# Altium schematic sheet FPGA_Supply.SchDoc: RNG RPI Interface
size 420 x 297 mm; Author: G.Kasprowicz; CompanyName: WUT ISE; DrawnBy: G.Kasprowicz; Organization: WUT ISE; Address1: PW ISE; Address2: Nowowiejska 15/19 00-665 Warsaw; Address3: gkasprow@gmail.com; Revision: 2; SheetNumber: -; SheetTotal: -; ModifiedBy: -; CheckedDate: -; Title2: FPGA supply; DivGrp: WUT ISE; Designer: G.Kasprowicz; ModifiedDate: -; ProjectName: Sensor Box
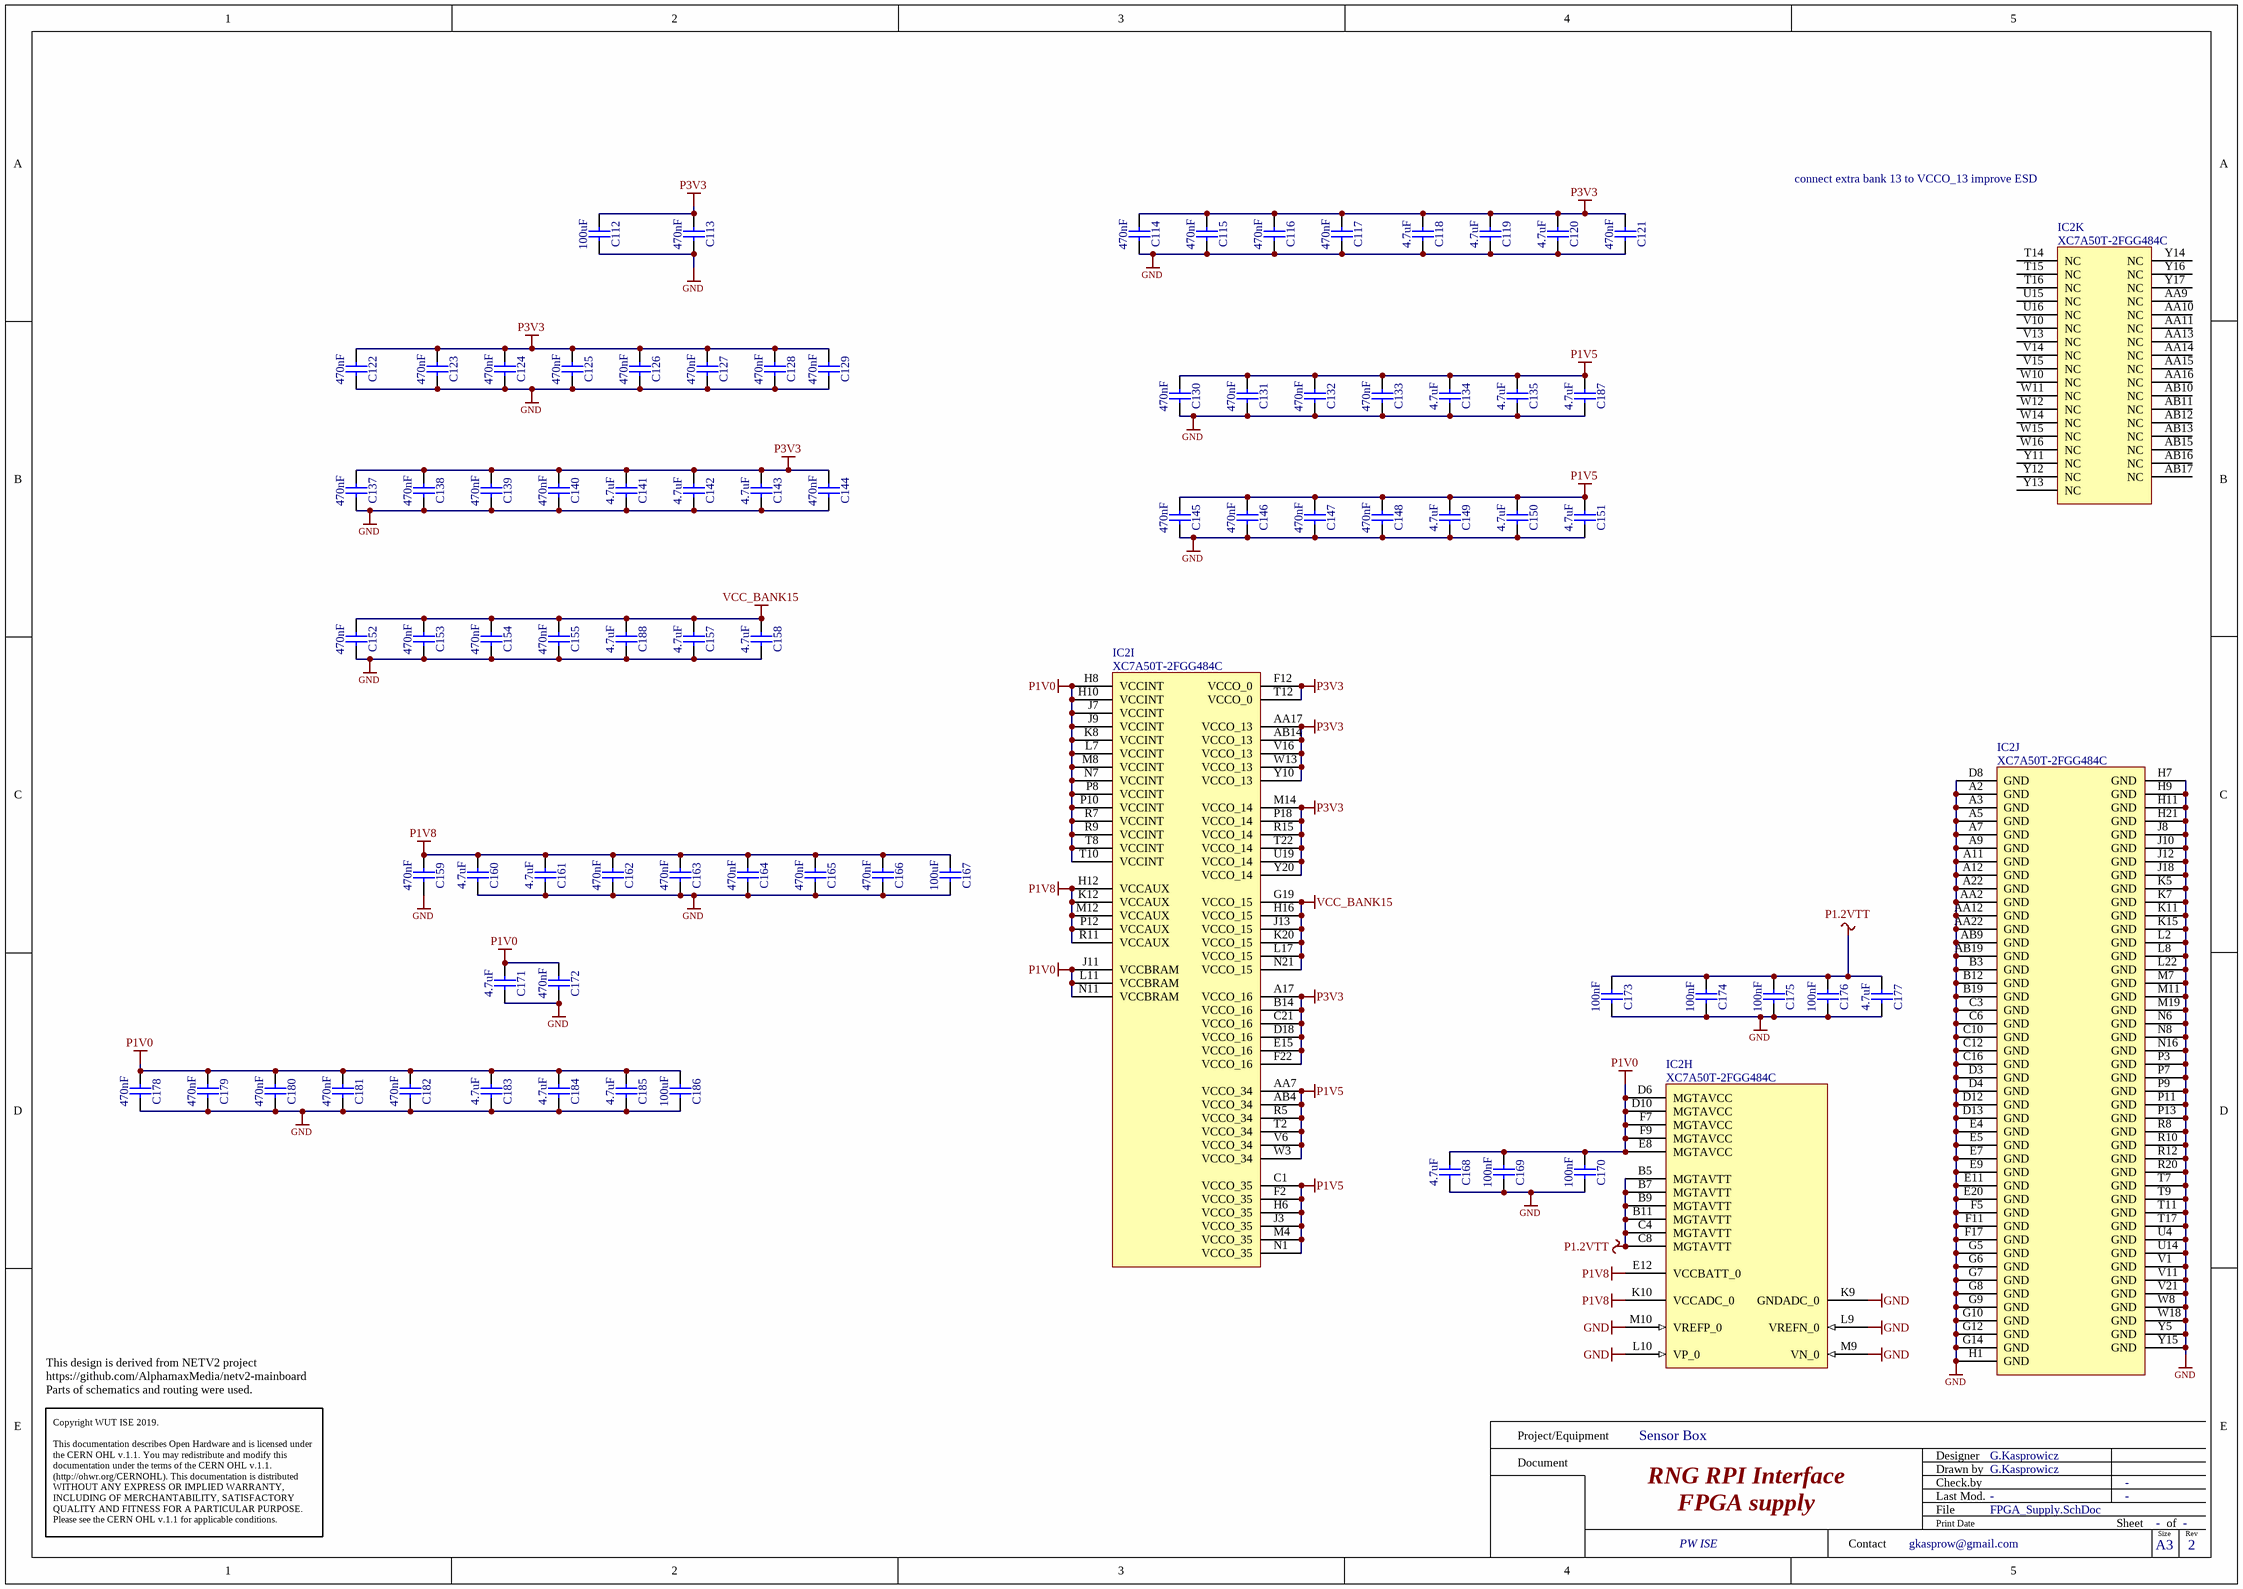
[diagram p0: FPGA_Supply.SchDoc]

## Parts
C112  100uF  [CAPC3216X180N]
C113  470nF  [CAPC0603X33N]
C114  470nF  [CAPC0603X33N]
C115  470nF  [CAPC0603X33N]
C116  470nF  [CAPC0603X33N]
C117  470nF  [CAPC0603X33N]
C118  4.7uF  [CAPC1005X55N]
C119  4.7uF  [CAPC1005X55N]
C120  4.7uF  [CAPC1005X55N]
C121  470nF  [CAPC0603X33N]
C122  470nF  [CAPC0603X33N]
C123  470nF  [CAPC0603X33N]
C124  470nF  [CAPC0603X33N]
C125  470nF  [CAPC0603X33N]
C126  470nF  [CAPC0603X33N]
C127  470nF  [CAPC0603X33N]
C128  470nF  [CAPC0603X33N]
C129  470nF  [CAPC0603X33N]
C130  470nF  [CAPC0603X33N]
C131  470nF  [CAPC0603X33N]
C132  470nF  [CAPC0603X33N]
C133  470nF  [CAPC0603X33N]
C134  4.7uF  [CAPC1005X55N]
C135  4.7uF  [CAPC1005X55N]
C137  470nF  [CAPC0603X33N]
C138  470nF  [CAPC0603X33N]
C139  470nF  [CAPC0603X33N]
C140  470nF  [CAPC0603X33N]
C141  4.7uF  [CAPC1005X55N]
C142  4.7uF  [CAPC1005X55N]
C143  4.7uF  [CAPC1005X55N]
C144  470nF  [CAPC0603X33N]
C145  470nF  [CAPC0603X33N]
C146  470nF  [CAPC0603X33N]
C147  470nF  [CAPC0603X33N]
C148  470nF  [CAPC0603X33N]
C149  4.7uF  [CAPC1005X55N]
C150  4.7uF  [CAPC1005X55N]
C151  4.7uF  [CAPC1005X55N]
C152  470nF  [CAPC0603X33N]
C153  470nF  [CAPC0603X33N]
C154  470nF  [CAPC0603X33N]
C155  470nF  [CAPC0603X33N]
C157  4.7uF  [CAPC1005X55N]
C158  4.7uF  [CAPC1005X55N]
C159  470nF  [CAPC0603X33N]
C160  4.7uF  [CAPC1005X55N]
C161  4.7uF  [CAPC1005X55N]
C162  470nF  [CAPC0603X33N]
C163  470nF  [CAPC0603X33N]
C164  470nF  [CAPC0603X33N]
C165  470nF  [CAPC0603X33N]
C166  470nF  [CAPC0603X33N]
C167  100uF  [CAPC3216X180N]
C168  4.7uF  [CAPC1005X55N]
C169  100nF  [CAPC0603X33N]
C170  100nF  [CAPC0603X33N]
C171  4.7uF  [CAPC1005X55N]
C172  470nF  [CAPC0603X33N]
C173  100nF  [CAPC0603X33N]
C174  100nF  [CAPC0603X33N]
C175  100nF  [CAPC0603X33N]
C176  100nF  [CAPC0603X33N]
C177  4.7uF  [CAPC1005X55N]
C178  470nF  [CAPC0603X33N]
C179  470nF  [CAPC0603X33N]
C180  470nF  [CAPC0603X33N]
C181  470nF  [CAPC0603X33N]
C182  470nF  [CAPC0603X33N]
C183  4.7uF  [CAPC1005X55N]
C184  4.7uF  [CAPC1005X55N]
C185  4.7uF  [CAPC1005X55N]
C186  100uF  [CAPC3216X180N]
C187  4.7uF  [CAPC1005X55N]
C188  4.7uF  [CAPC1005X55N]
IC2  XC7A50T-2FGG484C  [BGA484C100P22X22_2300X2300X260]  (parts H,I,J,K of 11)

## Nets
GND: C112.2 C113.2 C114.2 C115.2 C116.2 C117.2 C118.2 C119.2 C120.2 C121.2 C122.2 C123.2 C124.2 C125.2 C126.2 C127.2 C128.2 C129.2 C130.2 C131.2 C132.2 C133.2 C134.2 C135.2 C137.2 C138.2 C139.2 C140.2 C141.2 C142.2 C143.2 C144.2 C145.2 C146.2 C147.2 C148.2 C149.2 C150.2 C151.2 C152.2 C153.2 C154.2 C155.2 C157.2 C158.2 C159.2 C160.2 C161.2 C162.2 C163.2 C164.2 C165.2 C166.2 C167.2 C168.2 C169.2 C170.2 C171.2 C172.2 C173.2 C174.2 C175.2 C176.2 C177.2 C178.2 C179.2 C180.2 C181.2 C182.2 C183.2 C184.2 C185.2 C186.2 C187.2 C188.2 IC2.A2(GND) IC2.A3(GND) IC2.A5(GND) IC2.A7(GND) IC2.A9(GND) IC2.A11(GND) IC2.A12(GND) IC2.A22(GND) IC2.AA2(GND) IC2.AA12(GND) IC2.AA22(GND) IC2.AB9(GND) IC2.AB19(GND) IC2.B3(GND) IC2.B12(GND) IC2.B19(GND) IC2.C3(GND) IC2.C6(GND) IC2.C10(GND) IC2.C12(GND) IC2.C16(GND) IC2.D3(GND) IC2.D4(GND) IC2.D8(GND) IC2.D12(GND) IC2.D13(GND) IC2.E4(GND) IC2.E5(GND) IC2.E7(GND) IC2.E9(GND) IC2.E11(GND) IC2.E20(GND) IC2.F5(GND) IC2.F11(GND) IC2.F17(GND) IC2.G5(GND) IC2.G6(GND) IC2.G7(GND) IC2.G8(GND) IC2.G9(GND) IC2.G10(GND) IC2.G12(GND) IC2.G14(GND) IC2.H1(GND) IC2.H7(GND) IC2.H9(GND) IC2.H11(GND) IC2.H21(GND) IC2.J8(GND) IC2.J10(GND) IC2.J12(GND) IC2.J18(GND) IC2.K5(GND) IC2.K7(GND) IC2.K9(GNDADC_0) IC2.K11(GND) IC2.K15(GND) IC2.L2(GND) IC2.L8(GND) IC2.L9(VREFN_0) IC2.L10(VP_0) IC2.L22(GND) IC2.M7(GND) IC2.M9(VN_0) IC2.M10(VREFP_0) IC2.M11(GND) IC2.M19(GND) IC2.N6(GND) IC2.N8(GND) IC2.N16(GND) IC2.P3(GND) IC2.P7(GND) IC2.P9(GND) IC2.P11(GND) IC2.P13(GND) IC2.R8(GND) IC2.R10(GND) IC2.R12(GND) IC2.R20(GND) IC2.T7(GND) IC2.T9(GND) IC2.T11(GND) IC2.T17(GND) IC2.U4(GND) IC2.U14(GND) IC2.V1(GND) IC2.V11(GND) IC2.V21(GND) IC2.W8(GND) IC2.W18(GND) IC2.Y5(GND) IC2.Y15(GND)
P1.2VTT: C173.1 C174.1 C175.1 C176.1 C177.1 IC2.B5(MGTAVTT) IC2.B7(MGTAVTT) IC2.B9(MGTAVTT) IC2.B11(MGTAVTT) IC2.C4(MGTAVTT) IC2.C8(MGTAVTT)
P1V0: C168.1 C169.1 C170.1 C171.1 C172.1 C178.1 C179.1 C180.1 C181.1 C182.1 C183.1 C184.1 C185.1 C186.1 IC2.D6(MGTAVCC) IC2.D10(MGTAVCC) IC2.E8(MGTAVCC) IC2.F7(MGTAVCC) IC2.F9(MGTAVCC) IC2.H8(VCCINT) IC2.H10(VCCINT) IC2.J7(VCCINT) IC2.J9(VCCINT) IC2.J11(VCCBRAM) IC2.K8(VCCINT) IC2.L7(VCCINT) IC2.L11(VCCBRAM) IC2.M8(VCCINT) IC2.N7(VCCINT) IC2.N11(VCCBRAM) IC2.P8(VCCINT) IC2.P10(VCCINT) IC2.R7(VCCINT) IC2.R9(VCCINT) IC2.T8(VCCINT) IC2.T10(VCCINT)
P1V5: C130.1 C131.1 C132.1 C133.1 C134.1 C135.1 C145.1 C146.1 C147.1 C148.1 C149.1 C150.1 C151.1 C187.1 IC2.AA7(VCCO_34) IC2.AB4(VCCO_34) IC2.C1(VCCO_35) IC2.F2(VCCO_35) IC2.H6(VCCO_35) IC2.J3(VCCO_35) IC2.M4(VCCO_35) IC2.N1(VCCO_35) IC2.R5(VCCO_34) IC2.T2(VCCO_34) IC2.V6(VCCO_34) IC2.W3(VCCO_34)
P1V8: C159.1 C160.1 C161.1 C162.1 C163.1 C164.1 C165.1 C166.1 C167.1 IC2.E12(VCCBATT_0) IC2.H12(VCCAUX) IC2.K10(VCCADC_0) IC2.K12(VCCAUX) IC2.M12(VCCAUX) IC2.P12(VCCAUX) IC2.R11(VCCAUX)
P3V3: C112.1 C113.1 C114.1 C115.1 C116.1 C117.1 C118.1 C119.1 C120.1 C121.1 C122.1 C123.1 C124.1 C125.1 C126.1 C127.1 C128.1 C129.1 C137.1 C138.1 C139.1 C140.1 C141.1 C142.1 C143.1 C144.1 IC2.A17(VCCO_16) IC2.AA17(VCCO_13) IC2.AB14(VCCO_13) IC2.B14(VCCO_16) IC2.C21(VCCO_16) IC2.D18(VCCO_16) IC2.E15(VCCO_16) IC2.F12(VCCO_0) IC2.F22(VCCO_16) IC2.M14(VCCO_14) IC2.P18(VCCO_14) IC2.R15(VCCO_14) IC2.T12(VCCO_0) IC2.T22(VCCO_14) IC2.U19(VCCO_14) IC2.V16(VCCO_13) IC2.W13(VCCO_13) IC2.Y10(VCCO_13) IC2.Y20(VCCO_14)
VCC_BANK15: C152.1 C153.1 C154.1 C155.1 C157.1 C158.1 C188.1 IC2.G19(VCCO_15) IC2.H16(VCCO_15) IC2.J13(VCCO_15) IC2.K20(VCCO_15) IC2.L17(VCCO_15) IC2.N21(VCCO_15)

Not connected (* = marked no-connect by the designer): IC2 AA9(NC) AA10(NC) AA11(NC) AA13(NC) AA14(NC) AA15(NC) AA16(NC) AB10(NC) AB11(NC) AB12(NC) AB13(NC) AB15(NC) AB16(NC) AB17(NC) T14(NC) T15(NC) T16(NC) U15(NC) U16(NC) V10(NC) V13(NC) V14(NC) V15(NC) W10(NC) W11(NC) W12(NC) W14(NC) W15(NC) W16(NC) Y11(NC) Y12(NC) Y13(NC) Y14(NC) Y16(NC) Y17(NC)

## Notes on the sheet
- connect extra bank 13 to VCCO_13 improve ESD
- This design is derived from NETV2 project
  https://github.com/AlphamaxMedia/netv2-mainboard
  Parts of schematics and routing were used.
- Project/Equipment
- Document
- Designer
- Drawn by
- Check.by
- Copyright WUT ISE 2019.
  This documentation describes Open Hardware and is licensed under the CERN OHL v.1.1. You may redistribute and modify this documentation under the terms of the CERN OHL v.1.1. (http://ohwr.org/CERNOHL). This documentation is distributed WITHOUT ANY EXPRESS OR IMPLIED WARRANTY, INCLUDING OF MERCHANTABILITY, SATISFACTORY QUALITY AND FITNESS FOR A PARTICULAR PURPOSE. Please see the CERN OHL v.1.1 for applicable conditions.
- Contact
- File
- Last Mod.
- Print Date
- Sheet
- Size
- A3
- of
- Rev

## Library data of the parts
C112 C167 C186 = CC1206_100UF_6.3V_20%_X5R: Non-polarised capacitor; Part Description: SMD Multilayer Chip Ceramic Capacitor; Manufacturer: GENERIC; Manufacturer1 Part Number: C1206C107M9PACTU; Voltage: 6.3V; TC: X5R; Tolerance: ±10%; Part Number: CC1206_100UF_6.3V_20%_X5R; Component Kind: Standard; Component Type: Standard; Pin Count: 2; Value: 100uF; Status: None; Manufacturer Part Number: CC1206_100UF_6.3V_20%_X5R; Case: 1206; Mounted: Yes; Socket: No; SMD: Yes; Sense: No; Manufacturer1 Example: KEMET; Manufacturer1 ComponentHeight: 1.8mm; HelpURL: \\cern.ch\dfs\Applications\Altium\Datasheets\CC1206_X5R_KEMET.pdf; Author: CERN DEM JLC; CreateDate: 26.09.2012; LatestRevisionDate: 26.09.2012
C113-C117 C121-C133 C137-C140 C144-C148 C152-C155 C159 C162-C166 C172 C178-C182 = CC0201_470NF_4V_20%_X5R: Non-polarised capacitor; Part Description: SMD Multilayer Chip Ceramic Capacitor; Manufacturer: GENERIC; Manufacturer1 Part Number: AMK063BJ474MP-F; Voltage: 4V; TC: X5R; Tolerance: ±20%; Part Number: CC0201_470NF_4V_20%_X5R; Component Kind: Standard; Component Type: Standard; Pin Count: 2; Value: 470nF; Status: Not Recommended; Manufacturer Part Number: CC0201_470NF_4V_20%_X5R; Case: 0201; Mounted: Yes; Socket: No; SMD: Yes; Sense: No; Manufacturer1 Example: TAIYO YUDEN; Manufacturer1 ComponentHeight: 0.33mm; HelpURL: \\cern.ch\dfs\Applications\Altium\Datasheets\CC0201_X5R_TAIYO-YUDEN_STANDARD-CLASS2.pdf; Author: CERN DEM JLC; CreateDate: 27.05.2010; LatestRevisionDate: 27.05.2010
C118-C120 C134 C135 C141-C143 C149-C151 C157 C158 C160 C161 C168 C171 C177 C183-C185 C187 C188 = CC0402_4.7UF_6.3V_20%_X5R: Non-polarised capacitor; Part Description: SMD Multilayer Chip Ceramic Capacitor; Manufacturer: GENERIC; Manufacturer1 Part Number: C1005X5R0J475M050BC; Voltage: 6.3V; TC: X5R; Tolerance: ±20%; Part Number: CC0402_4.7UF_6.3V_20%_X5R; Component Kind: Standard; Component Type: Standard; Pin Count: 2; Value: 4.7uF; Status: Preferred; Manufacturer Part Number: CC0402_4.7UF_6.3V_20%_X5R; Case: 0402; Mounted: Yes; Socket: No; SMD: Yes; Sense: No; Manufacturer1 Example: TDK; Manufacturer1 ComponentHeight: 0.65mm; HelpURL: \\cern.ch\dfs\Applications\Altium\Datasheets\CC0402_X5R_TDK_C.pdf; Author: CERN DEM JLC; CreateDate: 03.03.2015; LatestRevisionDate: 03.03.2015
C169 C170 C173-C176 = CC0201_100NF_6.3V_10%_X5R: Non-polarised capacitor; Part Description: SMD Multilayer Chip Ceramic Capacitor; Manufacturer: GENERIC; Manufacturer1 Part Number: 02016D104KAT2A; Voltage: 6.3V; TC: X5R; Tolerance: ±10%; Part Number: CC0201_100NF_6.3V_10%_X5R; Component Kind: Standard; Component Type: Standard; Pin Count: 2; Value: 100nF; Status: Not Recommended; Manufacturer Part Number: CC0201_100NF_6.3V_10%_X5R; Case: 0201; Mounted: Yes; Socket: No; SMD: Yes; Sense: No; Manufacturer1 Example: AVX; Manufacturer1 ComponentHeight: 0.33mm; HelpURL: \\cern.ch\dfs\Applications\Altium\Datasheets\CC0201_X5R_AVX.pdf; Author: CERN DEM JLC; CreateDate: 03.12.2007; LatestRevisionDate: 03.12.2007
IC2 = XC7A50T-2FGG484C: Artix-7 FPGA, 4 GTPs, 250 User I/Os, 484-Ball Fine-Pitch Thin BGA (1.0mm Pitch), Speed Grade 2, Commercial Grade, Pb-Free; Manufacturer: XILINX; PressFit: No; Bonding: No; Part Number: XC7A50T-2FGG484C; Component Kind: Standard; Component Type: Standard; Device: XC7A50T-2FGG484C; PackageDescription: BGA, 1.00mm Pitch, Square; 484 Pin, 22 Columns x 22 Rows, Body 23mm X 23mm X 2.60mm H, IPC Medium Density; Part Description: Artix-7 FPGA, 4 GTPs, 250 User I/Os, 484-Ball Fine-Pitch Thin BGA (1.0mm Pitch), Speed Grade 2, Commercial Grade, Pb-Free; Manufacturer Part Number: XC7A50T-2FGG484C; Pin Count: 484; Case: BGA484; Mounted: Yes; Socket: No; SMD: Yes; Sense: No; ComponentHeight: 2.6mm; HelpURL: \\cern.ch\dfs\Applications\Altium\Datasheets\XC7A50T-2FGG484C.pdf; ComponentLink1URL: \\cern.ch\dfs\Applications\Altium\Datasheets\XC7A50T-2FGG484C_Package-Pinout.pdf; ComponentLink1Description: Package/Pinout; Author: CERN DEM JMW; CreateDate: 26.07.2018; LatestRevisionDate: 26.07.2018